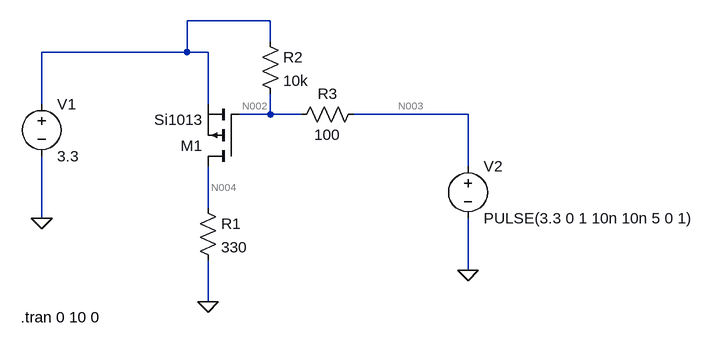
[diagram p0: schematic pmos_en_vdd.asc]
pmos_en_vdd.asc, the LTspice schematic file:
Version 4
SHEET 1 960 680
WIRE 288 -16 160 -16
WIRE 288 16 288 -16
WIRE 160 32 160 -16
WIRE 160 32 -64 32
WIRE 192 32 160 32
WIRE -64 112 -64 32
WIRE 192 112 192 32
WIRE 288 128 288 96
WIRE 288 128 240 128
WIRE 336 128 288 128
WIRE 592 128 416 128
WIRE 592 208 592 128
WIRE 192 272 192 208
WIRE -64 288 -64 192
WIRE 592 368 592 288
WIRE 192 416 192 352
FLAG -64 288 0
FLAG 192 416 0
FLAG 592 368 0
SYMBOL pmos 240 208 R180
SYMATTR InstName M1
SYMATTR Value Si1013
SYMBOL res 176 256 R0
SYMATTR InstName R1
SYMATTR Value 330
SYMBOL res 272 0 R0
SYMATTR InstName R2
SYMATTR Value 10k
SYMBOL res 432 112 R90
WINDOW 0 0 56 VBottom 2
WINDOW 3 32 56 VTop 2
SYMATTR InstName R3
SYMATTR Value 100
SYMBOL voltage -64 96 R0
WINDOW 123 0 0 Left 0
WINDOW 39 0 0 Left 0
SYMATTR InstName V1
SYMATTR Value 3.3
SYMBOL voltage 592 192 R0
WINDOW 123 0 0 Left 0
WINDOW 39 0 0 Left 0
SYMATTR InstName V2
SYMATTR Value PULSE(3.3 0 1 10n 10n 5 0 1)
TEXT -96 440 Left 2 !.tran 0 10 0

The netlist it stands for:
* pmos_en_vdd.asc
M1 N004 N002 N001 N001 Si1013
R1 N004 0 330
R2 N001 N002 10k
R3 N003 N002 100
V1 N001 0 3.3
V2 N003 0 PULSE(3.3 0 1 10n 10n 5 0 1)
.model NMOS NMOS
.model PMOS PMOS
.lib standard.mos
.tran 0 10 0
.backanno
.end

* Results of the author's LTspice run, read from the files saved beside the schematic
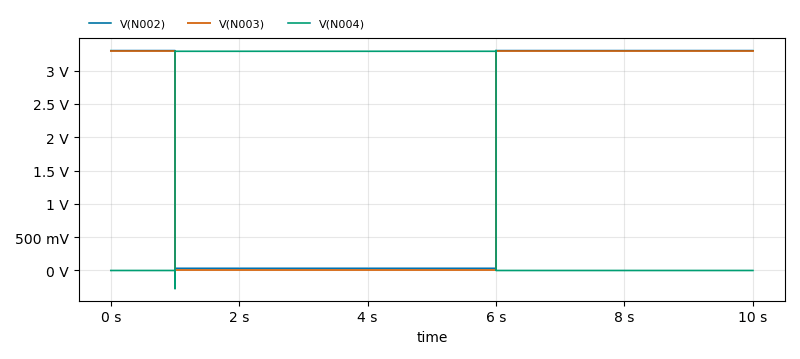
[diagram p1: Transient Analysis of pmos_en_vdd.asc, plotted from the saved traces]
* Transient Analysis, 1 run:
*   V(N002): min 32.61 mV, max 3.3 V, average 1.666 V, rms 2.334 V, last 3.3 V
*   V(N003): min 0 V, max 3.3 V, average 1.65 V, rms 2.333 V, last 3.3 V
*   V(N004): min -274.8 mV, max 3.304 V, average 1.645 V, rms 2.326 V, last 0 V